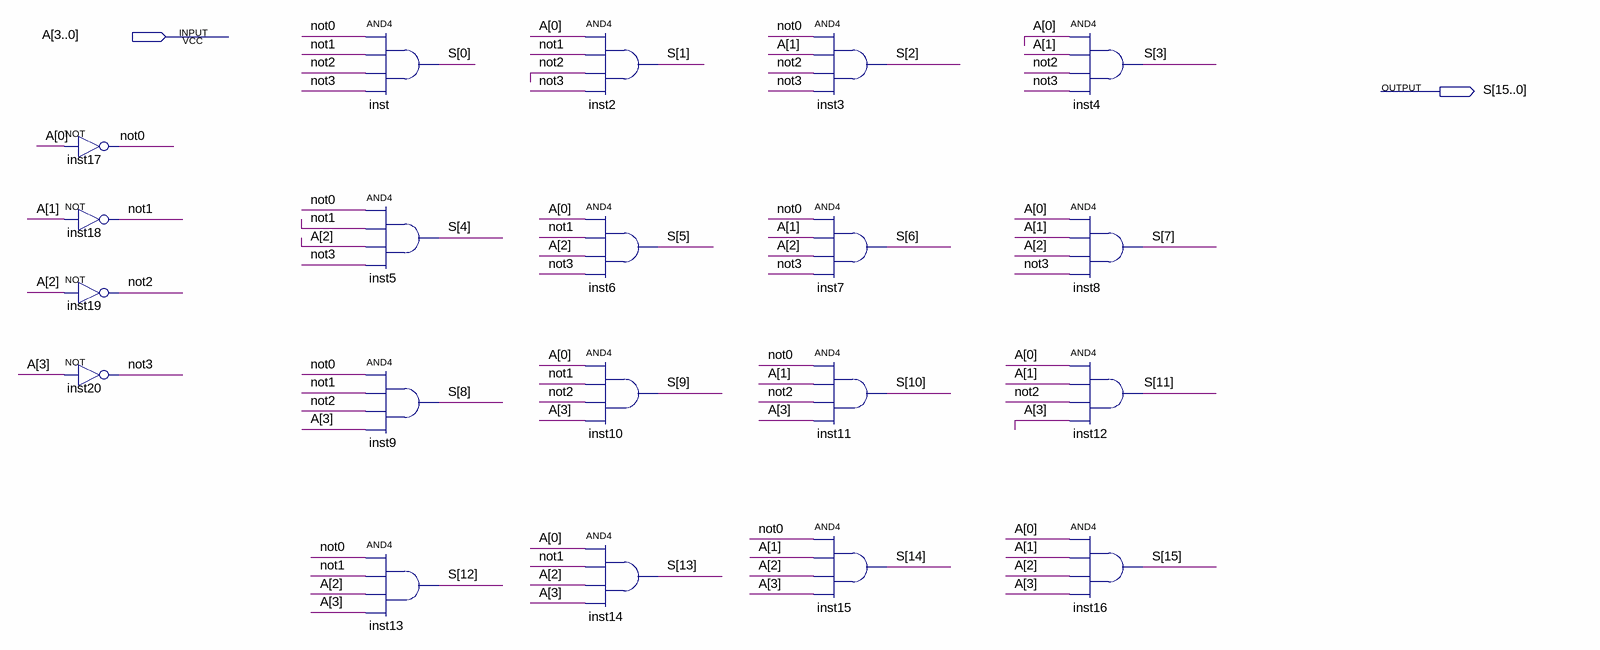
[diagram p0: schematic sheet]
// Quartus schematic Decod_4p16_4b.bdf as structural Verilog: 20 symbols, 2 pins
module Decod_4p16_4b (
  input  [3:0] A,
  output [15:0] S
);

  wire not0, not1, not2, not3;

  not inst17 (not0, A[0]);
  not inst18 (not1, A[1]);
  not inst19 (not2, A[2]);
  not inst20 (not3, A[3]);
  and inst (S[0], not0, not1, not2, not3);
  and inst5 (S[4], not0, not1, A[2], not3);
  and inst9 (S[8], not0, not1, not2, A[3]);
  and inst13 (S[12], not0, not1, A[2], A[3]);
  and inst2 (S[1], A[0], not1, not2, not3);
  and inst6 (S[5], A[0], not1, A[2], not3);
  and inst10 (S[9], A[0], not1, not2, A[3]);
  and inst14 (S[13], A[0], not1, A[2], A[3]);
  and inst3 (S[2], not0, A[1], not2, not3);
  and inst7 (S[6], not0, A[1], A[2], not3);
  and inst11 (S[10], not0, A[1], not2, A[3]);
  and inst15 (S[14], not0, A[1], A[2], A[3]);
  and inst4 (S[3], A[0], A[1], not2, not3);
  and inst8 (S[7], A[0], A[1], A[2], not3);
  and inst12 (S[11], A[0], A[1], not2, A[3]);
  and inst16 (S[15], A[0], A[1], A[2], A[3]);
endmodule
